# EAGLE design autolock (EAGLE 9.6.2)
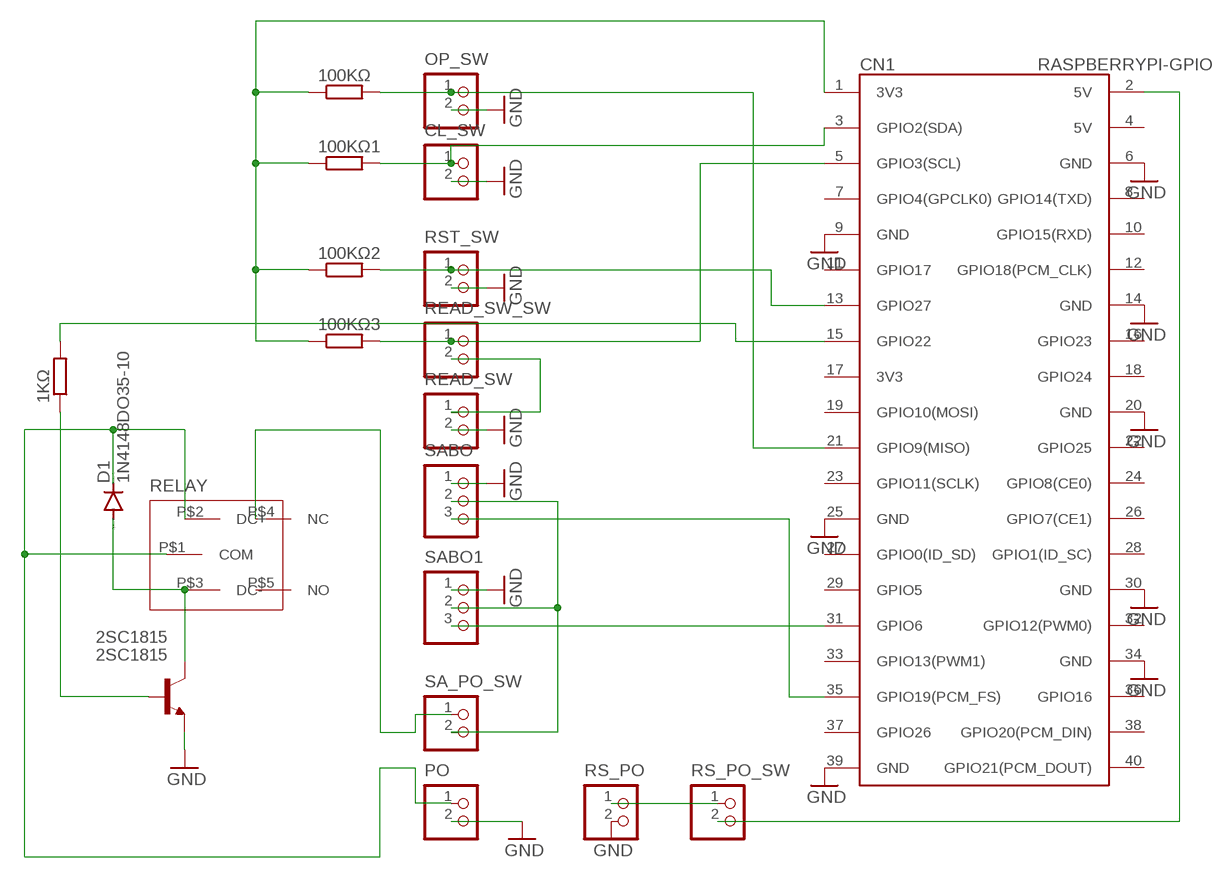
[diagram p0: schematic, sheet 1]

## Parts
1KΩ  R-EU_0207/10  [0207/10]
2SC1815  2SC1815  [TO92-ECB]
100KΩ  R-EU_0207/10  [0207/10]
100KΩ1  R-EU_0207/10  [0207/10]
100KΩ2  R-EU_0207/10  [0207/10]
100KΩ3  R-EU_0207/10  [0207/10]
CL_SW  B2B-XH-A  [B2B-XH-A]
CN1  RASPBERRYPI-GPIO  [2X20-BOLD]
D1  1N4148DO35-10  [DO35-10]
OP_SW  B2B-XH-A  [B2B-XH-A]
PO  B2B-XH-A  [B2B-XH-A]
READ_SW  B2B-XH-A  [B2B-XH-A]
READ_SW_SW  B2B-XH-A  [B2B-XH-A]
RELAY  SRD05VDCSLC  [SRD05VDCSLC]
RS_PO  B2B-XH-A  [B2B-XH-A]
RS_PO_SW  B2B-XH-A  [B2B-XH-A]
RST_SW  B2B-XH-A  [B2B-XH-A]
SA_PO_SW  B2B-XH-A  [B2B-XH-A]
SABO  B3B-XH-A  [B3B-XH-A]
SABO1  B3B-XH-A  [B3B-XH-A]

## Nets
GND: 2SC1815.E CL_SW.2 CN1.6(GND) CN1.9(GND) CN1.14(GND) CN1.20(GND) CN1.25(GND) CN1.30(GND) CN1.34(GND) CN1.39(GND) OP_SW.2 PO.2 READ_SW.2 RS_PO.2 RST_SW.2 SABO1.1 SABO.1
N$1: 2SC1815.C D1.A RELAY.P$3(DC-)
N$2: RS_PO.1 RS_PO_SW.1
N$3: 100KΩ1.1 100KΩ2.1 100KΩ3.1 100KΩ.1 CN1.1(3V3)
N$4: 1KΩ.2 CN1.15(GPIO22)
N$5: 100KΩ1.2 CL_SW.1 CN1.3(GPIO2(SDA))
N$6: SA_PO_SW.2 SABO1.2 SABO.2
N$7: CN1.35(GPIO19(PCM_FS)) SABO.3
N$9: D1.C PO.1 RELAY.P$1(COM) RELAY.P$2(DC+)
N$10: CN1.31(GPIO6) SABO1.3
N$11: READ_SW.1 READ_SW_SW.2
N$13: RELAY.P$4(NC) SA_PO_SW.1
N$15: CN1.2(5V) RS_PO_SW.2
N$16: 1KΩ.1 2SC1815.B
N$17: 100KΩ.2 CN1.21(GPIO9(MISO)) OP_SW.1
N$18: 100KΩ3.2 CN1.5(GPIO3(SCL)) READ_SW_SW.1
N$19: 100KΩ2.2 CN1.13(GPIO27) RST_SW.1
Unconnected: CN1.4(5V) CN1.7(GPIO4(GPCLK0)) CN1.8(GPIO14(TXD)) CN1.10(GPIO15(RXD)) CN1.11(GPIO17) CN1.12(GPIO18(PCM_CLK)) CN1.16(GPIO23) CN1.17(3V3) CN1.18(GPIO24) CN1.19(GPIO10(MOSI)) CN1.22(GPIO25) CN1.23(GPIO11(SCLK)) CN1.24(GPIO8(CE0)) CN1.26(GPIO7(CE1)) CN1.27(GPIO0(ID_SD)) CN1.28(GPIO1(ID_SC)) CN1.29(GPIO5) CN1.32(GPIO12(PWM0)) CN1.33(GPIO13(PWM1)) CN1.36(GPIO16) CN1.37(GPIO26) CN1.38(GPIO20(PCM_DIN)) CN1.40(GPIO21(PCM_DOUT)) RELAY.P$5(NO)

## Library data of the parts
1KΩ 100KΩ 100KΩ1-100KΩ3 = rcl:R-EU_: RESISTOR, European symbol; SPICEPREFIX: R
2SC1815 = transistor:2SC1815: NPN EPITAXIAL TRANSISTOR Source: TOSHIBA .. 2SC1815 1.pdf
CL_SW OP_SW PO READ_SW READ_SW_SW RS_PO RS_PO_SW RST_SW SA_PO_SW = jst-xh:B2B-XH-A: Wire-to-Board 2.5mm pitch top mount connector Source: http://www.jst-mfg.com/product/pdf/jpn/XH.pdf http://www.jst-mfg.com/product/detail.php?series=277
CN1 = GPIO:RASPBERRYPI-GPIO
D1 = diode:1N4148: DIODE high speed (Philips)
RELAY = SRD05VDCSLC:SRD05VDCSLC
SABO SABO1 = jst-xh:B3B-XH-A: Wire-to-Board 2.5mm pitch top mount connector Source: http://www.jst-mfg.com/product/pdf/jpn/XH.pdf http://www.jst-mfg.com/product/detail.php?series=277

## Board
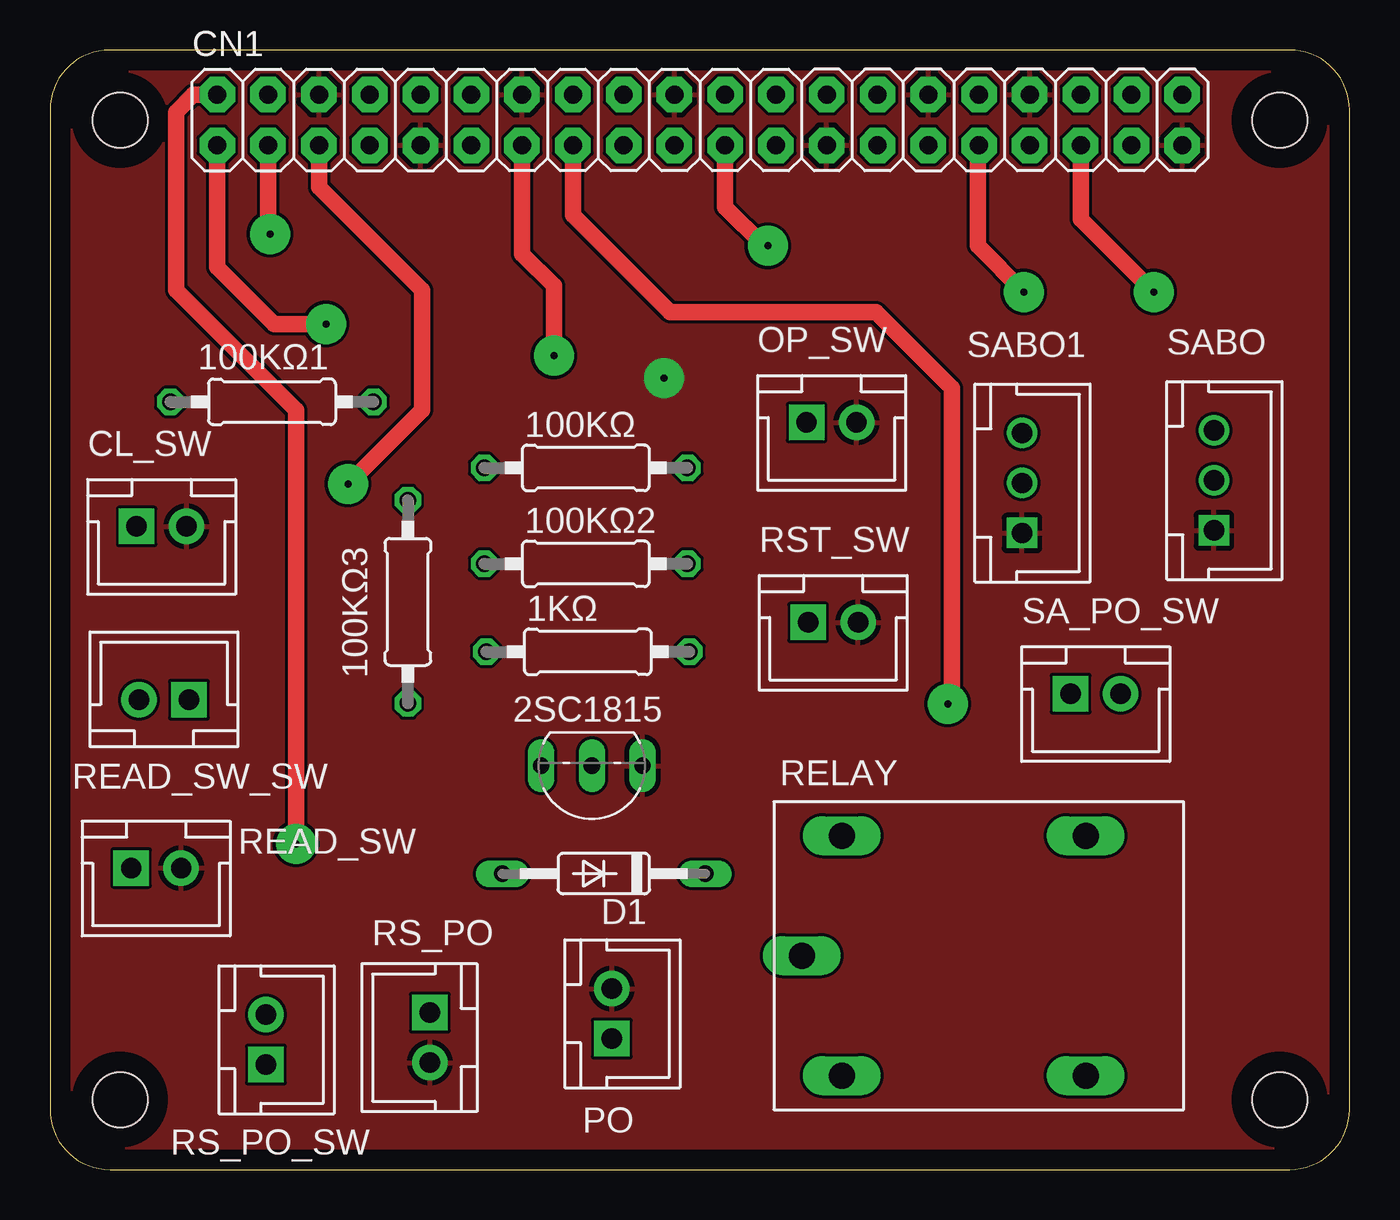
[diagram p1: board, top side]
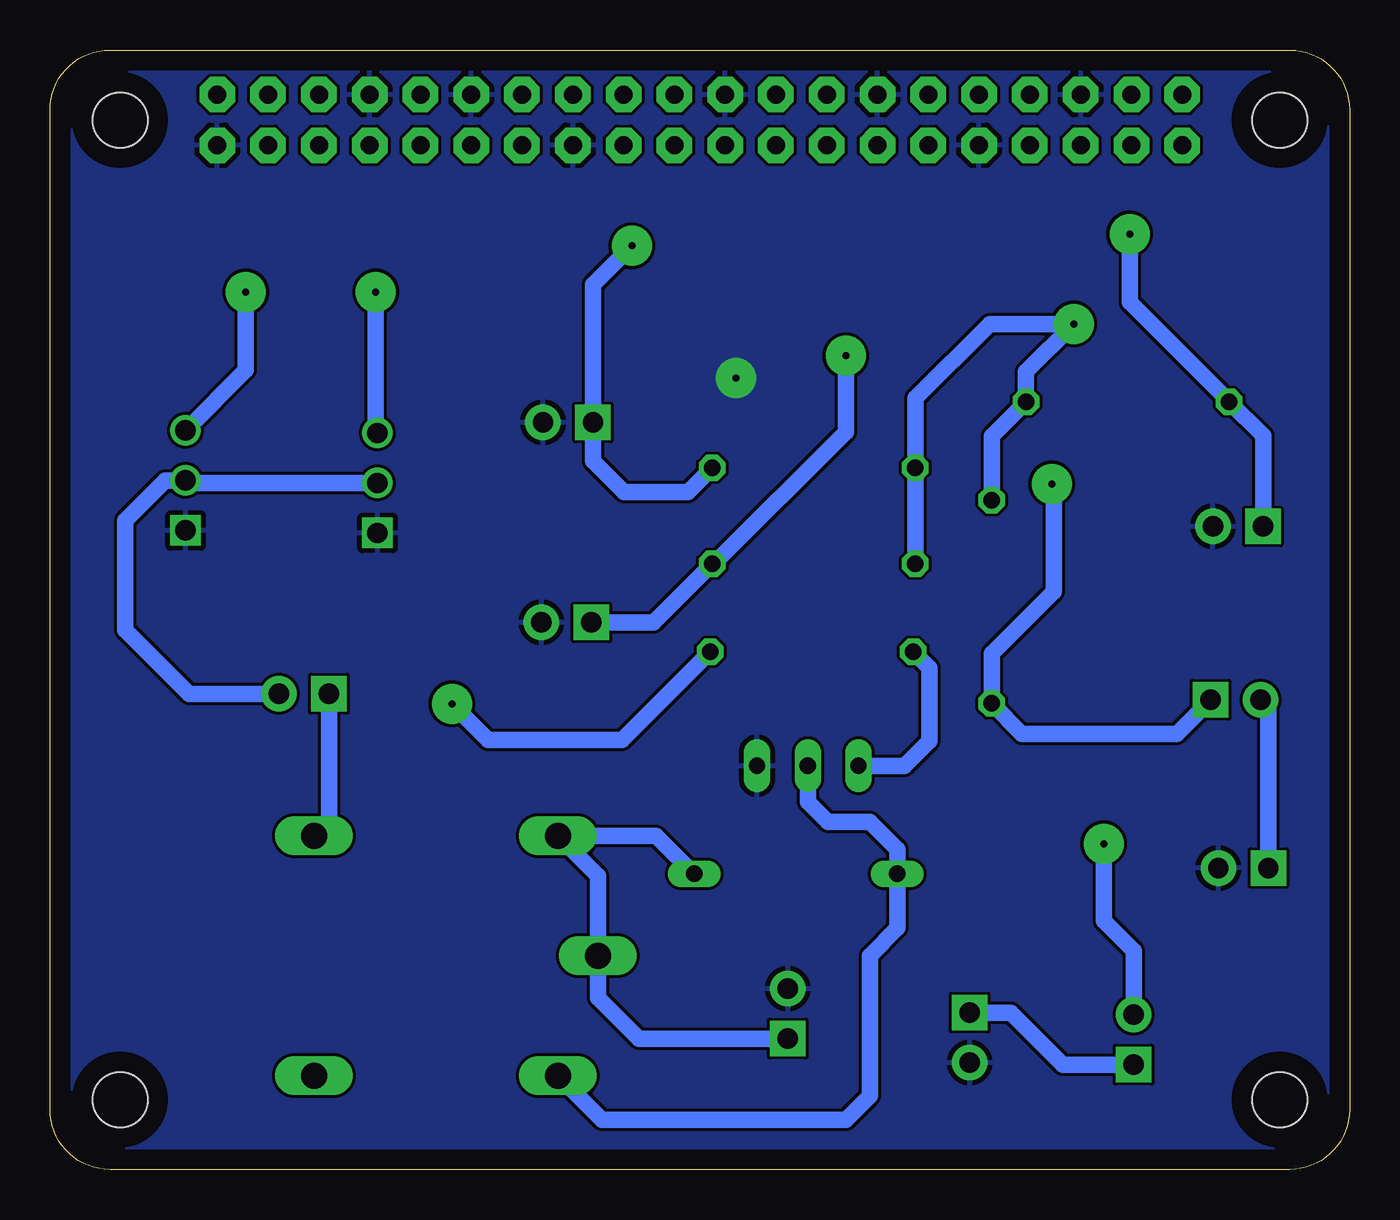
[diagram p2: board, bottom side, seen from below]

Size 65 x 56 mm. Coordinates in mm from the lower left corner, seen from the top.
Outline: 0,53 0,3 arc90 3,0 62,0 arc90 65,3 65,53 arc90 62,56 3,56 arc90 0,53
Copper layers (1*16): Top 0.035mm / dielectric 1.5mm / Bottom 0.035mm
Design rules "default": minimum track width 6mil, minimum drill 0.35mm, track to track 6mil, track to pad 6mil, pad to pad 6mil, via to via 6mil, smd to smd 6mil, copper to edge 40mil, drill to drill 6mil, minimum pad ring 10mil, minimum via ring 8mil, stop-mask expansion 4mil, vias tented up to drill 0mil, thermal gap 10mil
Holes 2.75 mm at 3.5,52.5 61.5,52.5 3.5,3.5 61.5,3.5

### Footprints (pad centres in the part's own frame; a part is rotated, then mirrored left to right if it is on the bottom)
0207/10 = drill 0.813 octagon: 1 -5.08,0; 2 5.08,0
TO92-ECB = drill 0.813 long: B 2.54,0; C 0,0; E -2.54,0
B2B-XH-A = drill 1.016 pad 1.778 square: 1 -1.25,0 | drill 1.016 pad 1.778: 2 1.25,0
2X20-BOLD = drill 0.9 pad 1.778 octagon: 1 -24.13,-1.27; 2 -24.13,1.27; 3 -21.59,-1.27; 4 -21.59,1.27; 5 -19.05,-1.27; 6 -19.05,1.27; 7 -16.51,-1.27; 8 -16.51,1.27; 9 -13.97,-1.27; 10 -13.97,1.27; 11 -11.43,-1.27; 12 -11.43,1.27; 13 -8.89,-1.27; 14 -8.89,1.27; 15 -6.35,-1.27; 16 -6.35,1.27; 17 -3.81,-1.27; 18 -3.81,1.27; 19 -1.27,-1.27; 20 -1.27,1.27; 21 1.27,-1.27; 22 1.27,1.27; 23 3.81,-1.27; 24 3.81,1.27; 25 6.35,-1.27; 26 6.35,1.27; 27 8.89,-1.27; 28 8.89,1.27; 29 11.43,-1.27; 30 11.43,1.27; 31 13.97,-1.27; 32 13.97,1.27; 33 16.51,-1.27; 34 16.51,1.27; 35 19.05,-1.27; 36 19.05,1.27; 37 21.59,-1.27; 38 21.59,1.27; 39 24.13,-1.27; 40 24.13,1.27
DO35-10 = drill 0.813 long: A 5.08,0; C -5.08,0
SRD05VDCSLC = drill 1.3 long: P$1 0,0; P$2 2,6; P$3 2,-6; P$4 14.2,6; P$5 14.2,-6
B3B-XH-A = drill 1.016 square: 1 -2.5,0 | drill 1.016: 2 0,0; 3 2.5,0

### Placement (x,y rotation side)
1KΩ  26.9,25.9 0 top
2SC1815  27.1,20.2 180 top
100KΩ  26.8,35.1 0 top
100KΩ1  11.1,38.4 180 top
100KΩ2  26.8,30.3 0 top
100KΩ3  17.9,28.4 270 top
CL_SW  5.58,32.17 0 top
CN1  32.5,52.5 0 top
D1  27.7,14.8 180 top
OP_SW  39.09,37.37 0 top
PO  28.1,7.8 90 top
READ_SW  5.31,15.08 0 top
READ_SW_SW  5.7,23.5 180 top
RELAY  37.6,10.7 0 top
RS_PO  19,6.6 270 top
RS_PO_SW  10.8,6.5 90 top
RST_SW  39.17,27.37 0 top
SA_PO_SW  52.3,23.8 0 top
SABO  58.22,34.47 90 top
SABO1  48.62,34.34 90 top

### Tracks (layer width: path | path; a pad name or v marks a point on that pad's centre or on a via)
GND  (via drill 0.35 pad 2)
  other vias: 30.7,39.6
  pour Bottom: -1.5,58 66.1,58 66.1,-0.4 -1.3,-0.4 -1.3,57.9
  pour Top: -1.8,58.1 -1.8,-1.1 66.8,-1.1 66.8,58.7 -1.5,58.7 -1.5,58.1
N$1
  Bottom 0.813: 2SC1815.C 27.1,18.4 26.1,17.4 24,17.4 22.62,16.02 D1.A 22.62,12.08 24,10.7 24,3.7 25.2,2.5 37.4,2.5 RELAY.P$3
N$2
  Bottom 0.813: RS_PO_SW.1 14.35,5.25 16.95,7.85 RS_PO.1
N$3  (via drill 0.35 pad 2)
  Top 0.813: CN1.1 8.37,45.13 11.2,42.3 v13.8,42.3
  Bottom 0.813: 100KΩ2.1 100KΩ.1 21.72,38.58 18,42.3 v13.8,42.3 16.18,39.92 100KΩ1.1 17.9,36.68 100KΩ3.1
N$4  (via drill 0.35 pad 2)
  Top 0.813: CN1.15 26.15,47.75 31,42.9 41.3,42.9 45.1,39.1 45.1,23.5 v44.9,23.3
  Bottom 0.813: v44.9,23.3 43.1,21.5 36.38,21.5 1KΩ.2
N$5  (via drill 0.35 pad 2)
  Top 0.813: 10.91,50.39 CN1.3 10.91,46.89 v11,46.8
  Bottom 0.813: v11,46.8 11,43.4 6.22,38.62 6.22,38.6 100KΩ1.2 4.32,36.7 CL_SW.1
N$6
  Bottom 0.813: SABO1.2 58.09,34.34 SABO.2 59.23,34.47 61.24,32.46 61.24,26.99 58.05,23.8 SA_PO_SW.2
N$7  (via drill 0.35 pad 2)
  Top 0.813: v55.2,43.9 51.55,47.55 CN1.35
  Bottom 0.813: SABO.3 55.2,39.99 v55.2,43.9
N$9
  Bottom 0.813: PO.1 35.55,6.55 37.6,8.6 RELAY.P$1 37.6,14.7 RELAY.P$2 34.68,16.7 D1.C
N$10  (via drill 0.35 pad 2)
  Top 0.813: CN1.31 46.47,50.57 46.4,50.5 46.4,46.2 v48.7,43.9
  Bottom 0.813: v48.7,43.9 48.7,36.92 SABO1.3
N$11
  Bottom 0.813: READ_SW_SW.2 4.06,23.11 READ_SW.1
N$13
  Bottom 0.813: SA_PO_SW.1 51.05,17.45 RELAY.P$4
N$15  (via drill 0.35 pad 2)
  Top 0.813: CN1.2 7.17,53.77 6.3,52.9 6.3,44 12.3,38 v12.3,16.3
  Bottom 0.813: v12.3,16.3 12.3,12.45 10.8,10.95 RS_PO_SW.2
N$16
  Bottom 0.813: 1KΩ.1 21.02,25.1 21.02,21.44 22.26,20.2 2SC1815.B
N$17  (via drill 0.35 pad 2)
  Top 0.813: CN1.21 33.77,48.13 35.7,46.2 v35.9,46.2
  Bottom 0.813: 100KΩ.2 33.08,33.9 36.3,33.9 37.84,35.44 OP_SW.1 37.84,44.26 v35.9,46.2
N$18  (via drill 0.35 pad 2)
  Top 0.813: v14.9,34.3 18.6,38 18.6,44 13.45,49.15 CN1.5
  Bottom 0.813: v14.9,34.3 14.8,34.3 14.8,28.92 17.9,25.82 100KΩ3.2 16.38,21.8 8.65,21.8 READ_SW_SW.1
N$19  (via drill 0.35 pad 2)
  Top 0.813: v25.2,40.7 25.2,44.2 23.6,45.8 CN1.13
  Bottom 0.813: RST_SW.1 34.81,27.37 100KΩ2.2 31.84,30.26 25.2,36.9 v25.2,40.7